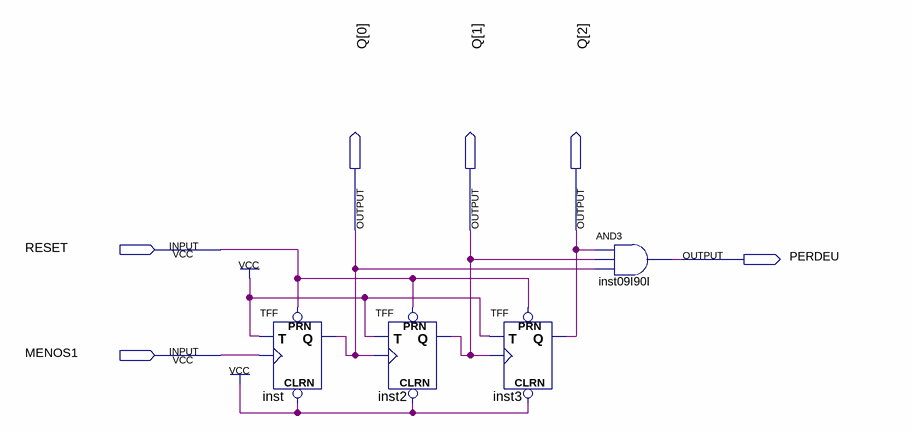
[diagram p0: schematic sheet]
// Quartus schematic vidas.bdf as structural Verilog: 4 symbols, 6 pins
module vidas (
  input  RESET,
  input  MENOS1,
  output [2:0] Q,
  output PERDEU
);

  TFF inst (.PRN(RESET), .CLRN(1'b1), .T(1'b1), .CLK(MENOS1), .Q(Q[0]));
  TFF inst2 (.PRN(RESET), .CLRN(1'b1), .T(1'b1), .CLK(Q[0]), .Q(Q[1]));
  TFF inst3 (.PRN(RESET), .CLRN(1'b1), .T(1'b1), .CLK(Q[1]), .Q(Q[2]));
  and inst09I90I (PERDEU, Q[2], Q[1], Q[0]);
endmodule
